# Altium schematic sheet Morpheus_MCU.SchDoc: BLE MCU
size Letter; Author: Dyke Shaffer; CompanyName: Hello, Inc.; Engineer: Dyke Shaffer; Organization: Hello, Inc.; Revision: EVT2; SheetNumber: 4; SheetTotal: 4; ProjectName: Hello Band
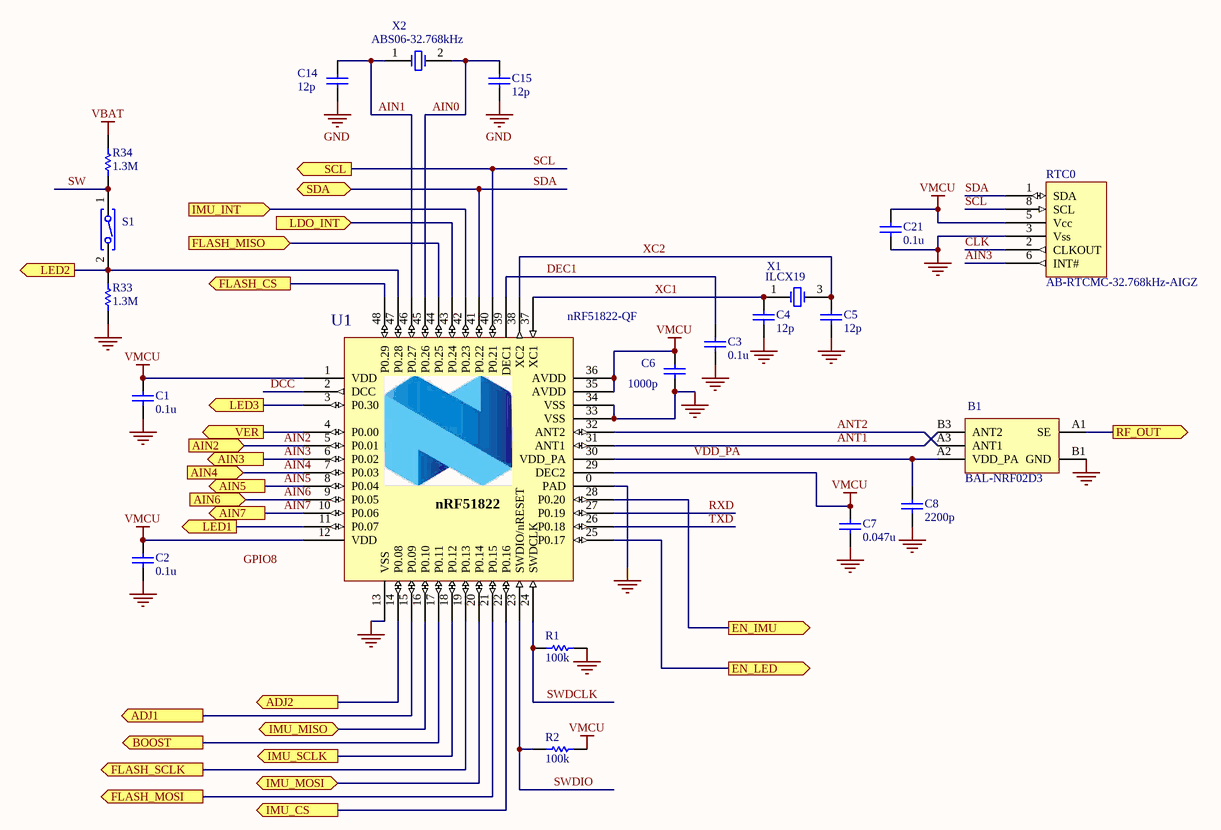
[diagram p0: Morpheus_MCU.SchDoc]

## Parts
B1  BAL-NRF02D3  [BAL-ST-WLCSP]
C1  0.1u  [CAP0402]
C2  0.1u  [CAP0402]
C3  0.1u  [CAP0402]
C4  12p  [CAP0402]
C5  12p  [CAP0402]
C6  1000p  [CAP0402]
C7  0.047u  [CAP0402]
C8  2200p  [CAP0402]
C14  12p  [CAP0402]
C15  12p  [CAP0402]
C21  0.1u  [CAP0402]
R1  100k  [RES0402]
R2  100k  [RES0402]
R33  1.3M  [RES0402]
R34  1.3M  [RES0402]
RTC0  AB-RTCMC-32.768kHz-AIGZ  [8-CLCC]
S1  REED_SPST_NO  [REED-10x1.8]  (value not drawn)
U1  nRF51822-QF  [VQFN40P600X600X100-48]
X1  ILCX19  [ILCX19]
X2  ABS06-32.768kHz  [ABS06]

## Ports
ADJ1 (out), ADJ2 (out), AIN2 (in), AIN3 (out), AIN4 (in), AIN5 (out), AIN6 (in), AIN7 (out), BOOST (out), EN_IMU (out), EN_LED (out), FLASH_CS (out), FLASH_MISO (in), FLASH_MOSI (out), FLASH_SCLK (out), IMU_CS (out), IMU_INT (in), IMU_MISO, IMU_MOSI, IMU_SCLK (out), LDO_INT (in), LED1 (out), LED2 (out), LED3 (out), RF_OUT (out), SCL (out), SDA, VER (out)

## Nets
GND: B1.B1(GND) C1.1 C2.1 C3.1 C4.1 C5.1 C6.1 C7.1 C8.1 C14.1 C15.1 C21.1 R1.2 R33.1 RTC0.3(Vss) U1.0(PAD) U1.13(VSS) U1.33(VSS) U1.34(VSS)
VBAT: R34.2
VMCU: C1.2 C2.2 C6.2 C7.2 C21.2 R2.2 RTC0.5(Vcc) U1.1(VDD) U1.12(VDD) U1.29(DEC2) U1.35(AVDD) U1.36(AVDD)
ADJ1: U1.15(P0.09) ; port ADJ1
ADJ2: U1.14(P0.08) ; port ADJ2
AIN0: C15.2 U1.45(P0.26) X2.2
AIN1: C14.2 U1.46(P0.27) X2.1
AIN2: U1.5(P0.01) ; port AIN2
AIN3: RTC0.6(INT#) U1.6(P0.02) ; port AIN3
AIN4: U1.7(P0.03) ; port AIN4
AIN5: U1.8(P0.04) ; port AIN5
AIN6: U1.9(P0.05) ; port AIN6
AIN7: U1.10(P0.06) ; port AIN7
ANT1: B1.B3(ANT2) U1.31(ANT1)
ANT2: B1.A3(ANT1) U1.32(ANT2)
BOOST: U1.17(P0.11) ; port BOOST
CLK: RTC0.2(CLKOUT)
DCC: U1.2(DCC)
DEC1: C3.2 U1.39(DEC1)
EN_IMU: U1.28(P0.20) ; port EN_IMU
EN_LED: U1.25(P0.17) ; port EN_LED
FLASH_CS: U1.48(P0.29) ; port FLASH_CS
FLASH_MISO: U1.44(P0.25) ; port FLASH_MISO
FLASH_MOSI: U1.21(P0.15) ; port FLASH_MOSI
FLASH_SCLK: U1.19(P0.13) ; port FLASH_SCLK
IMU_CS: U1.22(P0.16) ; port IMU_CS
IMU_INT: U1.42(P0.23) ; port IMU_INT
IMU_MISO: U1.16(P0.10) ; port IMU_MISO
IMU_MOSI: U1.20(P0.14) ; port IMU_MOSI
IMU_SCLK: U1.18(P0.12) ; port IMU_SCLK
LDO_INT: U1.43(P0.24) ; port LDO_INT
LED1: U1.11(P0.07) ; port LED1
LED2: R33.2 S1.2 U1.47(P0.28) ; port LED2
LED3: U1.3(P0.30) ; port LED3
RF_OUT: B1.A1(SE) ; port RF_OUT
RXD: U1.27(P0.19)
SCL: RTC0.8(SCL) U1.40(P0.21) ; port SCL
SDA: RTC0.1(SDA) U1.41(P0.22) ; port SDA
SW: R34.1 S1.1
SWDCLK: R1.1 U1.24(SWDCLK)
SWDIO: R2.1 U1.23(SWDIO/nRESET)
TXD: U1.26(P0.18)
VDD_PA: B1.A2(VDD_PA) C8.2 U1.30(VDD_PA)
VER: U1.4(P0.00) ; port VER
XC1: C4.2 U1.37(XC1) X1.1(XTAL1)
XC2: C5.2 U1.38(XC2) X1.3(XTAL2)

Not connected (* = marked no-connect by the designer): RTC0 4(NC) 7(NC)

## Notes on the sheet
- Labels drawn without touching a wire or pin: GPIO8
- TITLE
- DATE
- DRAWN BY
- REV
- SHEET
- OF
- (in symbol nRF51822_QF) nRF51822

## Library data of the parts
B1 = BAL-ST-5pin_DC-Flip: 50 ohm balun transformer for 2.45GHz ISM; Manufacturer: ST; Artikkelnr Noca: N.A.; Part Number: BAL-NRF02D3; Manufacturer Part Number: BAL-NRF02D3; Datasheet: *; LatestRevisionDate: 2013-05-15; Pin Count: 5; Publisher: Nordic Semiconductor; Published: 2013-05-15; Value: BAL-NRF02D3; Note: BAL-NRF02D3; Supplier: *; Supplier part number: *; 2nd source Supplier: *; 2nd source part number: *
C1-C3 C21 = C_0.1u_10_50_X7R_0402: Chip capacitor; Vendor: Taiyo Yuden; PN: UMK105B7104KV-FR; Tolerance: 10%; Voltage: 50V; Temp: X7R; Value: 0.1u; Size: 0402
C4 C5 C14 C15 = C_27p_5_50_C0G_0402: Chip capacitor; Vendor: Murata; PN: GRM1535C1H120JDD5D; Tolerance: 5%; Voltage: 50V; Temp: C0G; Value: 12p; Size: 0402
C6 = C_1000p_10_50_X7R_0402: Chip capacitor; Vendor: Murata; PN: GRM155R71H102KA01D; Tolerance: 10%; Voltage: 50V; Temp: X7R; Value: 1000p; Size: 0402
C7 = C_0.047u_10_16_X7R_0402: Chip capacitor; Vendor: Taiyo Yuden; PN: EMK105B7473KV-F; Tolerance: 10%; Voltage: 16V; Temp: X7R; Value: 0.047u; Size: 0402
C8 = C_2200p_5_16_STD_0402: Chip capacitor; Vendor: Taiyo Yuden; PN: EMK105SD222JV-F; Tolerance: 5 %; Voltage: 16V; Temp: Standard; Value: 2200p; Size: 0402
R1 R2 = R_100k_1_0.1_0402: Chip Resistor; Vendor: Panasonic; Tolerance: 1 %; Power: 0.1 W; PN: ERJ-2RKF1003X; Model: *; Value: 100k; Size: 0402
R33 R34 = R_1.3M_5_0.1_0402_1: Chip Resistor; Vendor: Panasonic; Tolerance: 5 %; Power: 0.1 W; PN: ERJ-2GEJ135X; Model: *; Value: 1.3M; Size: 0402
RTC0 = AB-RTCMC-32.768kHz-AIGZ: Abracon I2C RTC w/ integrated XO
S1 = SW_REED_SPST_NO: SWITCH REED SPST NO
U1 = nRF51822_QF: Multi-protocol Bluetooth Low Energy and 2.4GHz proprietary system-on-chip; Manufacturer: Nordic Semiconductor; Note: nRF51822 - VQFN48 6x6 0.4mm pitch; Artikkelnr Noca: N.A.; Part Number: nRF51822-QF; Manufacturer Part Number: nRF51822-QF; Datasheet: *; Footprint: VQFN48; LatestRevisionDate: 2013-04-10; Pin Count: 48; Publisher: Nordic Semiconductor; Published: 2012-06-12; Value: nRF51822-QF; Supplier: Nordic Semiconductor; Supplier part number: *; 2nd source Supplier: *; 2nd source part number: *
X1 = ILCX19: ILSI ILCX19 Crystal Oscillator
X2 = ABS06: Abracon ABS06 32.768kHz XO 2.0x1.2x0.6mm; Vendor: Abracon; Value: 32.768kHz